# Altium schematic sheet Master.SchDoc
size A; SheetNumber: 1; SheetTotal: 7
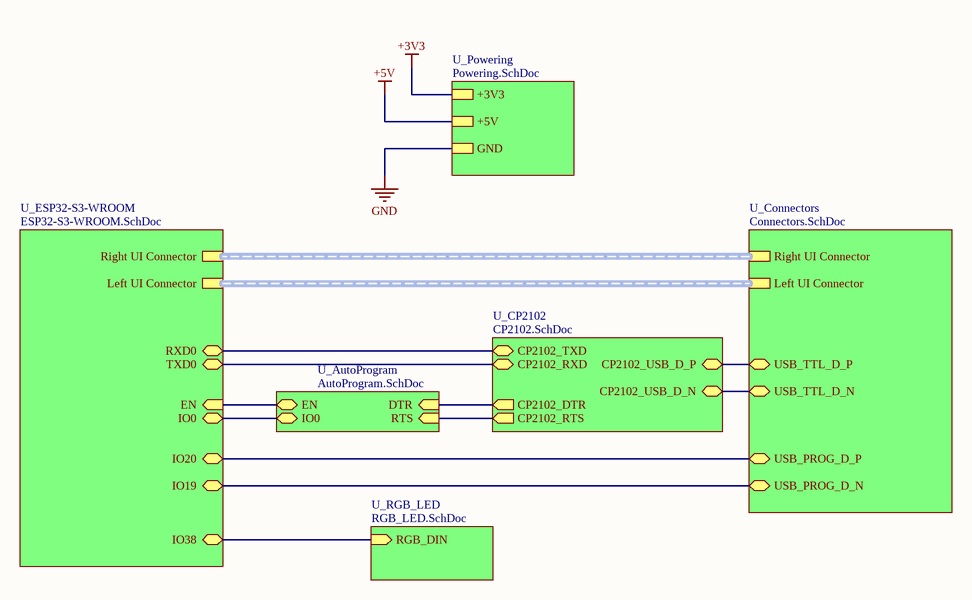
[diagram p0: Master.SchDoc]

## Sub-sheets
U_AutoProgram = AutoProgram.SchDoc: DTR (in), RTS (in), EN (bidir), IO0 (bidir)
U_Connectors = Connectors.SchDoc: Right UI Connector (harness Right UI Connector), Left UI Connector (harness Left UI Connector), USB_TTL_D_P (bidir), USB_TTL_D_N (bidir), USB_PROG_D_P (bidir), USB_PROG_D_N (bidir)
U_CP2102 = CP2102.SchDoc: CP2102_USB_D_P (bidir), CP2102_USB_D_N (bidir), CP2102_TXD (bidir), CP2102_RXD (bidir), CP2102_RTS (out), CP2102_DTR (out)
U_ESP32-S3-WROOM = ESP32-S3-WROOM.SchDoc: Right UI Connector (harness Right UI Connector), Left UI Connector (harness Left UI Connector), EN (in), RXD0 (bidir), TXD0 (bidir), IO0 (bidir), IO19 (bidir), IO20 (bidir), IO38 (bidir)
U_Powering = Powering.SchDoc: +3V3, +5V, GND
U_RGB_LED = RGB_LED.SchDoc: RGB_DIN (in)

## Nets
+3V3: sheet U_Powering/+3V3
+5V: sheet U_Powering/+5V
GND: sheet U_Powering/GND
(unnamed): sheet U_ESP32-S3-WROOM/EN, sheet U_AutoProgram/EN
(unnamed): sheet U_ESP32-S3-WROOM/RXD0, sheet U_CP2102/CP2102_TXD
(unnamed): sheet U_ESP32-S3-WROOM/TXD0, sheet U_CP2102/CP2102_RXD
(unnamed): sheet U_ESP32-S3-WROOM/IO0, sheet U_AutoProgram/IO0
(unnamed): sheet U_ESP32-S3-WROOM/IO19, sheet U_Connectors/USB_PROG_D_N
(unnamed): sheet U_ESP32-S3-WROOM/IO20, sheet U_Connectors/USB_PROG_D_P
(unnamed): sheet U_ESP32-S3-WROOM/IO38, sheet U_RGB_LED/RGB_DIN
(unnamed): sheet U_Connectors/USB_TTL_D_P, sheet U_CP2102/CP2102_USB_D_P
(unnamed): sheet U_Connectors/USB_TTL_D_N, sheet U_CP2102/CP2102_USB_D_N
(unnamed): sheet U_CP2102/CP2102_RTS, sheet U_AutoProgram/RTS
(unnamed): sheet U_CP2102/CP2102_DTR, sheet U_AutoProgram/DTR

## Buses and harness runs
harness sheet U_Connectors/Left UI Connector = sheet U_ESP32-S3-WROOM/Left UI Connector
harness sheet U_Connectors/Right UI Connector = sheet U_ESP32-S3-WROOM/Right UI Connector